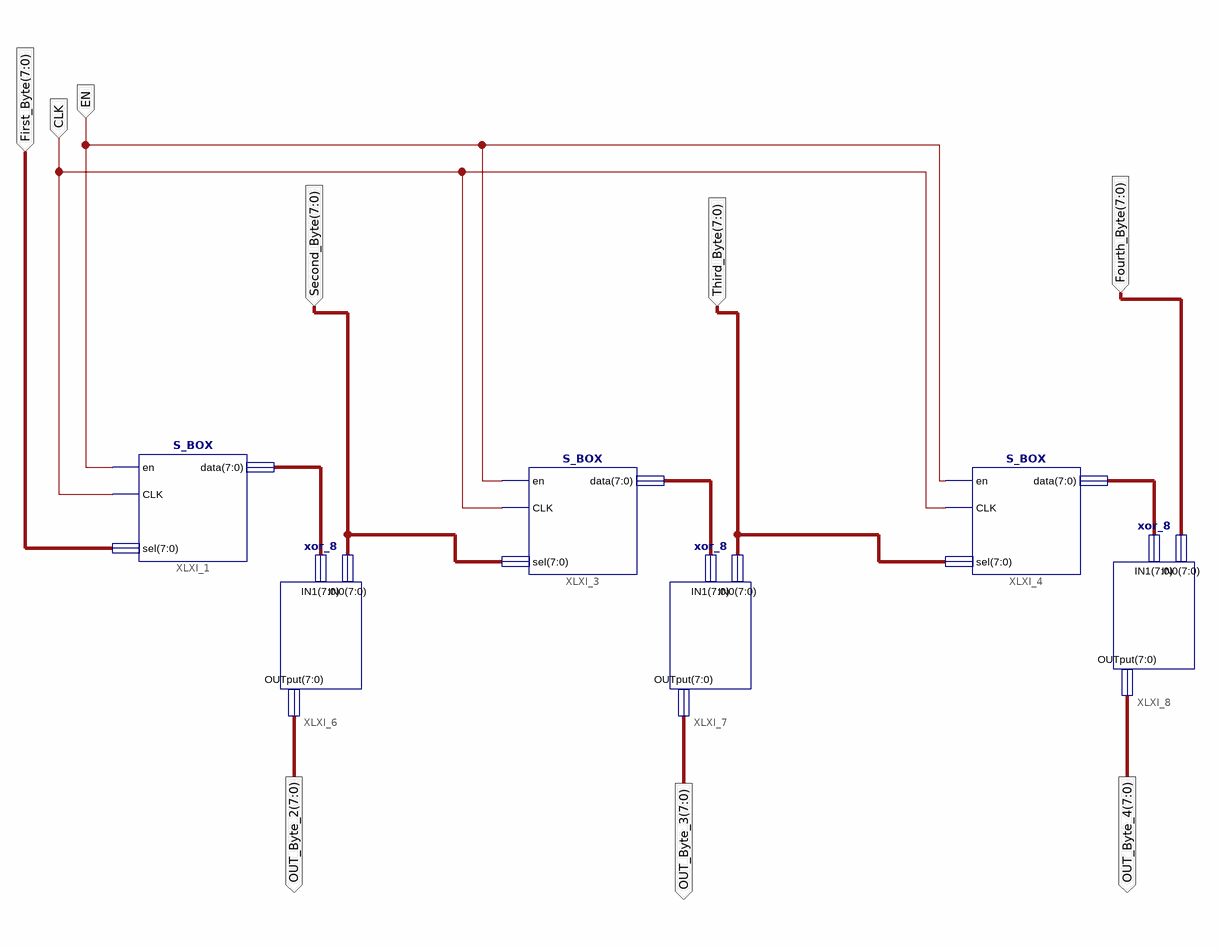
[diagram p0: schematic sheet 1]
// Xilinx ISE schematic Main.sch (spartan3e) as structural Verilog: 6 symbols, 9 ports
module Main (
  input  [7:0] First_Byte,
  input  EN,
  input  CLK,
  input  [7:0] Third_Byte,
  input  [7:0] Second_Byte,
  input  [7:0] Fourth_Byte,
  output [7:0] OUT_Byte_2,
  output [7:0] OUT_Byte_3,
  output [7:0] OUT_Byte_4
);

  wire [7:0] XLXN_21, XLXN_22, XLXN_23;

  S_BOX XLXI_1 (.en(EN), .CLK(CLK), .sel(First_Byte), .data(XLXN_22));
  S_BOX XLXI_3 (.en(EN), .CLK(CLK), .sel(Second_Byte), .data(XLXN_23));
  S_BOX XLXI_4 (.en(EN), .CLK(CLK), .sel(Third_Byte), .data(XLXN_21));
  xor_8 XLXI_6 (.IN0(Second_Byte), .IN1(XLXN_22), .OUTput(OUT_Byte_2));
  xor_8 XLXI_7 (.IN0(Third_Byte), .IN1(XLXN_23), .OUTput(OUT_Byte_3));
  xor_8 XLXI_8 (.IN0(Fourth_Byte), .IN1(XLXN_21), .OUTput(OUT_Byte_4));
endmodule
